# Altium schematic sheet Magnetic-Charger.SchDoc
size A; SheetNumber: 11; SheetTotal: 15
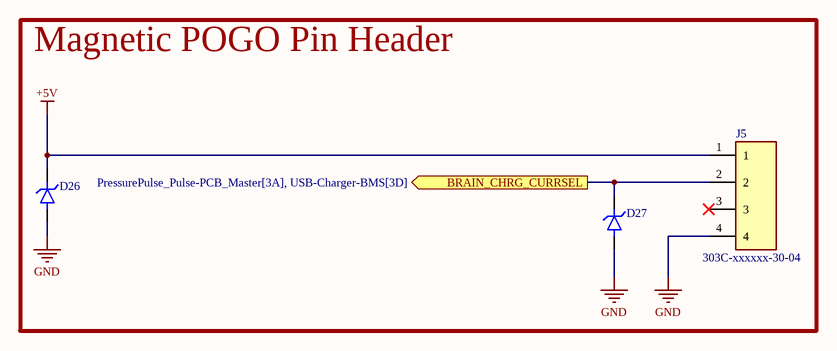
[diagram p0: Magnetic-Charger.SchDoc]

## Parts
D26  RCLAMP0521P.TCT  [BDFN2C051V40]  (value not drawn)
D27  RCLAMP0521P.TCT  [BDFN2C051V40]  (value not drawn)
J5  303C-xxxxxx-30-04  [MAG POGO - 4 POS MALE]

## Blocks framed on the sheet
Magnetic POGO Pin Header: D26 D27 J5

## Ports
BRAIN_CHRG_CURRSEL (out, see PressurePulse_Pulse-PCB_Master[3A], USB-Charger-BMS[3D])

## Nets
+5V: D26.K J5.1
GND: D26.A D27.A J5.4
BRAIN_CHRG_CURRSEL: D27.K J5.2 ; port BRAIN_CHRG_CURRSEL

Not connected (* = marked no-connect by the designer): J5 3*

## Library data of the parts
D26 D27 = TVS DIODE: 25V Clamp 4A (8/20µs) Ipp Tvs Diode Surface Mount SLP1006P2; MFR: BORN; Type: SMD; Value: BDFN2C051V40; MFR PN: BDFN2C051V40; JLCPCB PN: C152023
J5 = 303C-xxxxxx-30-04: MAGNETIC POGO 4POS; MFR: ATTEND Technology; MFR PN: 303C-321018-30-04; Value: DNS; JLCPCB PN: *